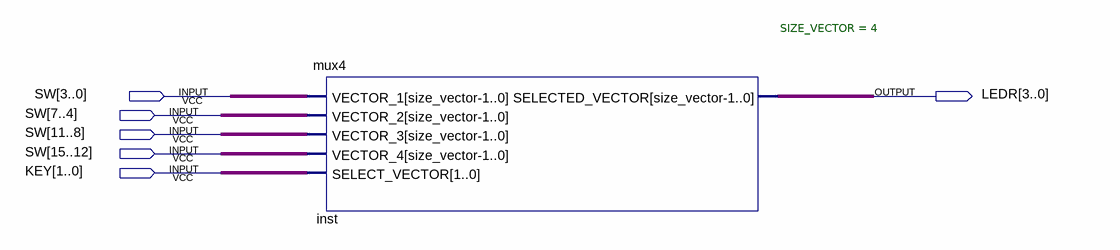
[diagram p0: schematic sheet]
// Quartus schematic mux4_test.bdf as structural Verilog: 1 symbols, 6 pins
module mux4_test (
  input  [15:0] SW,
  input  [1:0] KEY,
  output [3:0] LEDR
);

  mux4 #(.SIZE_VECTOR(4)) inst (
    .VECTOR_1(SW[3:0]), .VECTOR_2(SW[7:4]), .VECTOR_3(SW[11:8]), .VECTOR_4(SW[15:12]), .SELECT_VECTOR(KEY),
    .SELECTED_VECTOR(LEDR));
endmodule
